# Altium project Bierautomat.PrjPcb
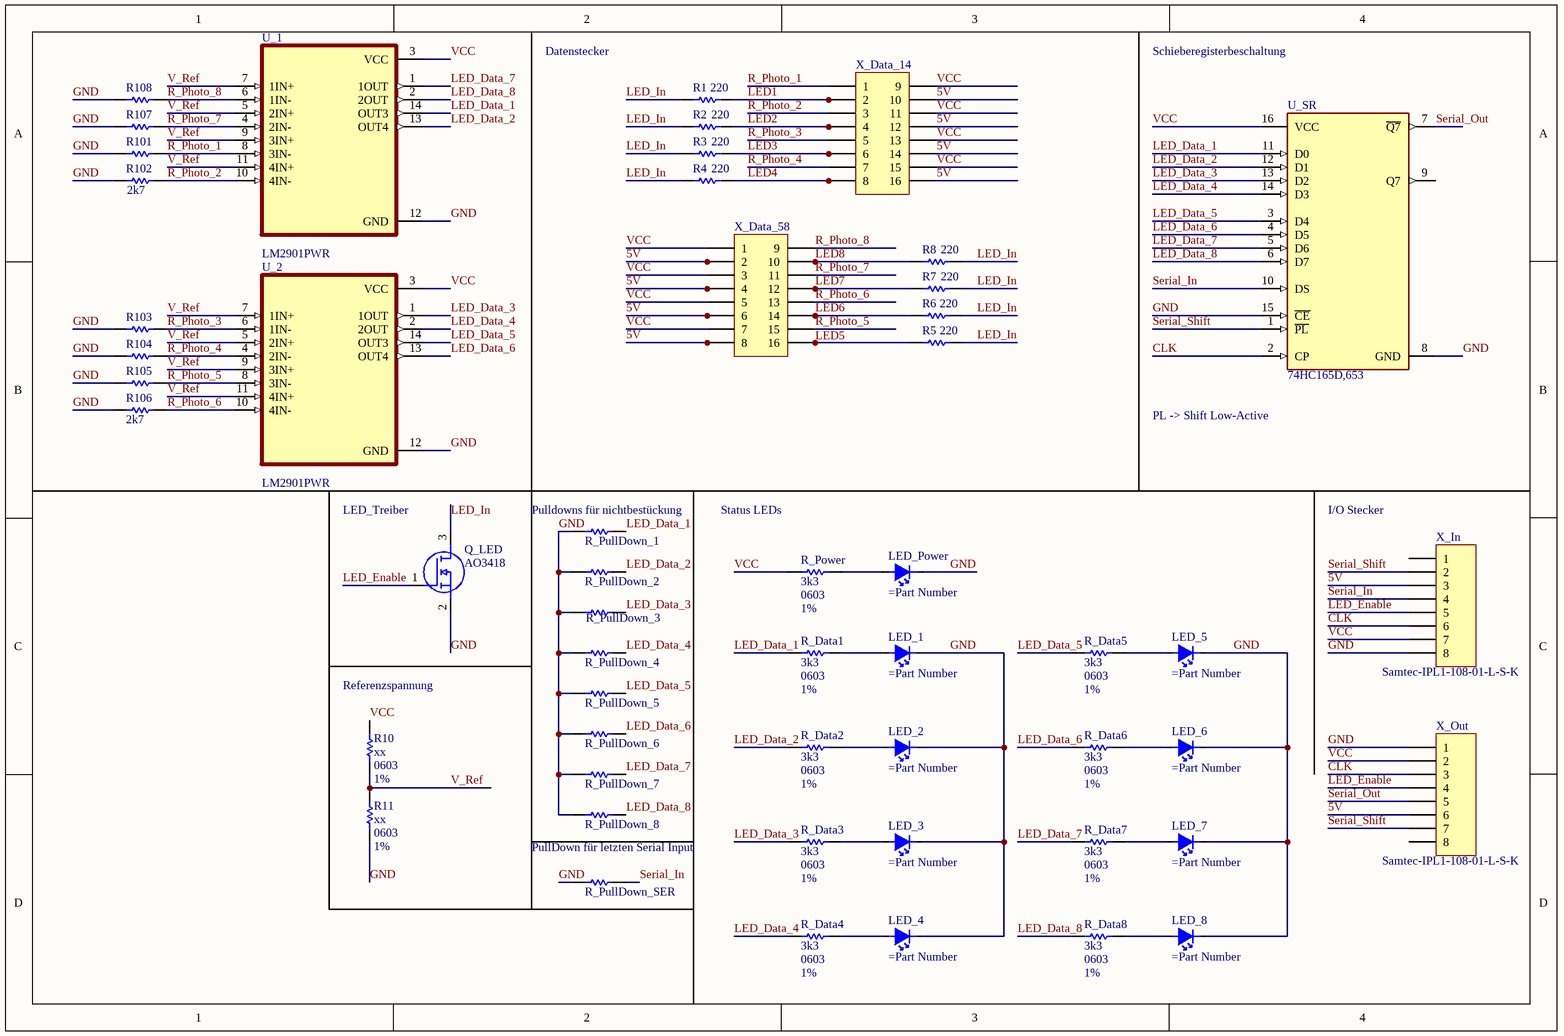
[diagram p0: Schieberegister_Trägerplatine.SchDoc]
3 sheets, 60 parts. Net scope: hierarchical (ports join the sheet entries above them; power ports are global).
Board files: ESP_Träger.PcbDoc, SR_Träger.PcbDoc
Sheets:
  Schieberegister_Trägerplatine.SchDoc
  ESP_Trägerplatine.SchDoc
    U_ESP_32 = ESP_32.SchDoc

## Sheet Schieberegister_Trägerplatine.SchDoc
size A4; SheetNumber: 1; SheetTotal: 1; SPICEModelCacheYDPVZOWB: <root> / <DocumentId>YDPVZOWB</DocumentId> / </root>

### Parts
LED_1  (no value)  [150060XX75000]
LED_2  (no value)  [150060XX75000]
LED_3  (no value)  [150060XX75000]
LED_4  (no value)  [150060XX75000]
LED_5  (no value)  [150060XX75000]
LED_6  (no value)  [150060XX75000]
LED_7  (no value)  [150060XX75000]
LED_8  (no value)  [150060XX75000]
LED_Power  (no value)  [150060XX75000]
Q_LED  AO3418  [SOT95P280X125-3N]
R1  value 220  [0603_resistor_flat]
R2  value 220  [0603_resistor_flat]
R3  value 220  [0603_resistor_flat]
R4  value 220  [0603_resistor_flat]
R5  value 220  [0603_resistor_flat]
R6  value 220  [0603_resistor_flat]
R7  value 220  [0603_resistor_flat]
R8  value 220  [0603_resistor_flat]
R10  value xx  Case_EIA: 0603  Tolerance: 1%  [0603_resistor_flat]
R11  value xx  Case_EIA: 0603  Tolerance: 1%  [0603_resistor_flat]
R101  (no value)  [0603_resistor_flat]
R102  2k7  [0603_resistor_flat]
R103  (no value)  [0603_resistor_flat]
R104  (no value)  [0603_resistor_flat]
R105  (no value)  [0603_resistor_flat]
R106  2k7  [0603_resistor_flat]
R107  (no value)  [0603_resistor_flat]
R108  (no value)  [0603_resistor_flat]
R_Data1  value 3k3  Case_EIA: 0603  Tolerance: 1%  [0603_resistor_flat]
R_Data2  value 3k3  Case_EIA: 0603  Tolerance: 1%  [0603_resistor_flat]
R_Data3  value 3k3  Case_EIA: 0603  Tolerance: 1%  [0603_resistor_flat]
R_Data4  value 3k3  Case_EIA: 0603  Tolerance: 1%  [0603_resistor_flat]
R_Data5  value 3k3  Case_EIA: 0603  Tolerance: 1%  [0603_resistor_flat]
R_Data6  value 3k3  Case_EIA: 0603  Tolerance: 1%  [0603_resistor_flat]
R_Data7  value 3k3  Case_EIA: 0603  Tolerance: 1%  [0603_resistor_flat]
R_Data8  value 3k3  Case_EIA: 0603  Tolerance: 1%  [0603_resistor_flat]
R_Power  value 3k3  Case_EIA: 0603  Tolerance: 1%  [0603_resistor_flat]
R_PullDown_1  (no value)  [0603_resistor_flat]
R_PullDown_2  (no value)  [0603_resistor_flat]
R_PullDown_3  (no value)  [0603_resistor_flat]
R_PullDown_4  (no value)  [0603_resistor_flat]
R_PullDown_5  (no value)  [0603_resistor_flat]
R_PullDown_6  (no value)  [0603_resistor_flat]
R_PullDown_7  (no value)  [0603_resistor_flat]
R_PullDown_8  (no value)  [0603_resistor_flat]
R_PullDown_SER  (no value)  [0603_resistor_flat]
U_1  LM2901PWR  [SOP65P640X120-14N]
U_2  LM2901PWR  [SOP65P640X120-14N]
U_SR  74HC165D,653  [FP-SOT109-1-MFG]
X_Data_14  Samtec-IPL1-108-01-L-D-K  [Samtec-IPL1-108-01-L-D-K]  (value not drawn)
X_Data_58  Samtec-IPL1-108-01-L-D-K  [Samtec-IPL1-108-01-L-D-K]  (value not drawn)
X_In  Samtec-IPL1-108-01-L-S-K  [Samtec-IPL1-108-01-L-S-K]
X_Out  Samtec-IPL1-108-01-L-S-K  [Samtec-IPL1-108-01-L-S-K]

### Nets
5V: X_Data_14.10 X_Data_14.12 X_Data_14.14 X_Data_14.16 X_Data_58.2 X_Data_58.4 X_Data_58.6 X_Data_58.8 X_In.3 X_Out.6
CLK: U_SR.2(CP) X_In.6 X_Out.3
GND: LED_1.1(Cathode) LED_2.1(Cathode) LED_3.1(Cathode) LED_4.1(Cathode) LED_5.1(Cathode) LED_6.1(Cathode) LED_7.1(Cathode) LED_8.1(Cathode) LED_Power.1(Cathode) Q_LED.2(S) R11.1 R101.1 R102.1 R103.1 R104.1 R105.1 R106.1 R107.1 R108.1 R_PullDown_1.1 R_PullDown_2.1 R_PullDown_3.1 R_PullDown_4.1 R_PullDown_5.1 R_PullDown_6.1 R_PullDown_7.1 R_PullDown_8.1 R_PullDown_SER.1 U_1.12(GND) U_2.12(GND) U_SR.8(GND) U_SR.15(~{CE}) X_In.8 X_Out.1
LED1: R1.1 X_Data_14.2
LED2: R2.1 X_Data_14.4
LED3: R3.1 X_Data_14.6
LED4: R4.1 X_Data_14.8
LED5: R5.1 X_Data_58.16
LED6: R6.1 X_Data_58.14
LED7: R7.1 X_Data_58.12
LED8: R8.1 X_Data_58.10
LED_Data_1: R_Data1.2 R_PullDown_1.2 U_1.14(OUT3) U_SR.11(D0)
LED_Data_2: R_Data2.2 R_PullDown_2.2 U_1.13(OUT4) U_SR.12(D1)
LED_Data_3: R_Data3.2 R_PullDown_3.2 U_2.1(1OUT) U_SR.13(D2)
LED_Data_4: R_Data4.2 R_PullDown_4.2 U_2.2(2OUT) U_SR.14(D3)
LED_Data_5: R_Data5.2 R_PullDown_5.2 U_2.14(OUT3) U_SR.3(D4)
LED_Data_6: R_Data6.2 R_PullDown_6.2 U_2.13(OUT4) U_SR.4(D5)
LED_Data_7: R_Data7.2 R_PullDown_7.2 U_1.1(1OUT) U_SR.5(D6)
LED_Data_8: R_Data8.2 R_PullDown_8.2 U_1.2(2OUT) U_SR.6(D7)
LED_Enable: Q_LED.1(G) X_In.5 X_Out.4
LED_In: Q_LED.3(D) R1.2 R2.2 R3.2 R4.2 R5.2 R6.2 R7.2 R8.2
R_Photo_1: R101.2 U_1.8(3IN-) X_Data_14.1
R_Photo_2: R102.2 U_1.10(4IN-) X_Data_14.3
R_Photo_3: R103.2 U_2.6(1IN-) X_Data_14.5
R_Photo_4: R104.2 U_2.4(2IN-) X_Data_14.7
R_Photo_5: R105.2 U_2.8(3IN-) X_Data_58.15
R_Photo_6: R106.2 U_2.10(4IN-) X_Data_58.13
R_Photo_7: R107.2 U_1.4(2IN-) X_Data_58.11
R_Photo_8: R108.2 U_1.6(1IN-) X_Data_58.9
Serial_In: R_PullDown_SER.2 U_SR.10(DS) X_In.4
Serial_Out: U_SR.7(~{Q7}) X_Out.5
Serial_Shift: U_SR.1(~{PL}) X_In.2 X_Out.7
V_Ref: R10.1 R11.2 U_1.5(2IN+) U_1.7(1IN+) U_1.9(3IN+) U_1.11(4IN+) U_2.5(2IN+) U_2.7(1IN+) U_2.9(3IN+) U_2.11(4IN+)
VCC: R10.2 R_Power.2 U_1.3(VCC) U_2.3(VCC) U_SR.16(VCC) X_Data_14.9 X_Data_14.11 X_Data_14.13 X_Data_14.15 X_Data_58.1 X_Data_58.3 X_Data_58.5 X_Data_58.7 X_In.7 X_Out.2
NetLED_1_2: LED_1.2(Anode) R_Data1.1
NetLED_2_2: LED_2.2(Anode) R_Data2.1
NetLED_3_2: LED_3.2(Anode) R_Data3.1
NetLED_4_2: LED_4.2(Anode) R_Data4.1
NetLED_5_2: LED_5.2(Anode) R_Data5.1
NetLED_6_2: LED_6.2(Anode) R_Data6.1
NetLED_7_2: LED_7.2(Anode) R_Data7.1
NetLED_8_2: LED_8.2(Anode) R_Data8.1
NetLED_Power_2: LED_Power.2(Anode) R_Power.1

Not connected (* = marked no-connect by the designer): U_SR 9(Q7); X_In 1; X_Out 8

### Notes on the sheet
- Datenstecker
- Schieberegisterbeschaltung
- PL -> Shift Low-Active
- (near Q_LED) LED_Treiber
- (near R_PullDown_1) Pulldowns für nichtbestückung
- Status LEDs
- I/O Stecker
- (near R10) Referenzspannung
- PullDown für letzten Serial Input

### Library data of the parts
LED_1-LED_8 LED_Power = LED_0603: 0603 SMD mono-color Chip LED, WL-SMCW / BS: Blue, GS: Green, RS: Red, SS: super red, VS: bright green, YS: yellow; Part Number: 150060*75000; Manufacturer: Würth; possible_colors: BS, GS, RS, SS, VS, YS; Case_EIA: 0603; Color: *
Q_LED = AO3418: MOSFET N-CH 30V 3.8A SOT23; Manufacturer_Name: Alpha & Omega Semiconductors; Geometry.Height: 1.25mm; Arrow Part Number: AO3418; Arrow Price/Stock: https://www.arrow.com/en/products/ao3418/alpha-and-omega-semiconductor; Manufacturer_Part_Number: AO3418; Datasheet Link: https://www.arrow.com/en/products/ao3418/alpha-and-omega-semiconductor
R1-R8 R101-R108 R_PullDown_1-R_PullDown_8 R_PullDown_SER = R_0603: Resistor, 0603, 5% default, 0.1 W; E12: 1K0, 1K2, 1K5, 1K8, 2K2, 2K7, 3K3, 3K9, 4K7, 5K6, 6K8, 8K2; Case_Metric: 1608; Power_Dissipation: 100mW; Part Number: ='R_' + Case_EIA + '_' + Tolerance + '_' + Value
R10 R11 = R_0603: Resistor, 0603, 5% default, 0.1 W; Part Number: R_0603_1%_xx; E12: 1K0, 1K2, 1K5, 1K8, 2K2, 2K7, 3K3, 3K9, 4K7, 5K6, 6K8, 8K2; Case_Metric: 1608; Power_Dissipation: 100mW
R_Data1-R_Data8 R_Power = R_0603: Resistor, 0603, 5% default, 0.1 W; Part Number: R_0603_1%_3k3; E12: 1K0, 1K2, 1K5, 1K8, 2K2, 2K7, 3K3, 3K9, 4K7, 5K6, 6K8, 8K2; Case_Metric: 1608; Power_Dissipation: 100mW
U_1 U_2 = LM2901PWR: Quad differential comparator, automotive grade 14-TSSOP -40 to 125; MF: Texas; Check_prices: https://www.snapeda.com/parts/LM2901PWR/Texas%20Instruments/view-part/1145769/?ref=eda; Price: None; SnapEDA_Link: https://www.snapeda.com/parts/LM2901PWR/Texas%20Instruments/view-part/1145769/?ref=snap; Availability: Good; MP: LM2901PWR; Value: *; Purchase-URL: https://pricing.snapeda.com/search/part/LM2901PWR/?ref=eda; Package: TSSOP-14 Rohm
U_SR = CMP-14351-000001-1: IC SHIFT REGST 8BIT PI-SO 16SOIC; Manufacturer: Nexperia; Standoff Height: 0.1mm; Number Of Inputs: 8; Logic Function Desc: Shift Register; Nominal Supply Current: 8uA; Number Of Circuits: 1; Propagation Delay: 15ns; Min Supply Voltage: 2V; Frequency: 61MHz; Max Supply Voltage: 6V; Height: 1.75mm; Digikey Description: IC SHIFT REGST 8BIT PI-SO 16SOIC; ComponentLink2URL: https://assets.nexperia.com/documents/data-sheet/74HC_HCT165.pdf; Ipc Land Pattern Name: SOP127P600X175-16; Temperature Range High: +125°C; Manufacturer Part Number: 74HC165D,653; Temperature: -40°C to +125°C; Device Class L2: Logic ICs; Device Class L1: Integrated Circuits (ICs); Lead Free: Yes; Number Of Outputs: 1; Ambient Temperature Range High: +125°C; ComponentLink2Description: Datasheet; Temperature Range Low: -40°C; Category: IC; RoHS: TRUE; Automotive: No; Device Class L3: Shift Registers; Octopart: https://octopart.com/74hc165d%2C653-nexperia-78737091; Footprint Url: https://assets.nexperia.com/documents/outline-drawing/SOT109-1.pdf; Ambient Temperature Range Low: -40°C; Package: SOT109-1
X_Data_14 X_Data_58 = Samtec-IPL1-108-01-L-D-K: Header, 8-Pin, Dual row; Value: Samtec; LatestRevisionDate: 17-Jul-2002; LatestRevisionNote: Re-released for DXP Platform.; Publisher: Altium Limited
X_In X_Out = IPL1-108-01-L-S-K: Header, 8-Pin; LatestRevisionDate: 17-Jul-2002; LatestRevisionNote: Re-released for DXP Platform.; Publisher: Altium Limited; Value: Samtec-IPL1-108-01-L-S-K

## Sheet ESP_Trägerplatine.SchDoc
size A4; SheetNumber: 1; SheetTotal: 3
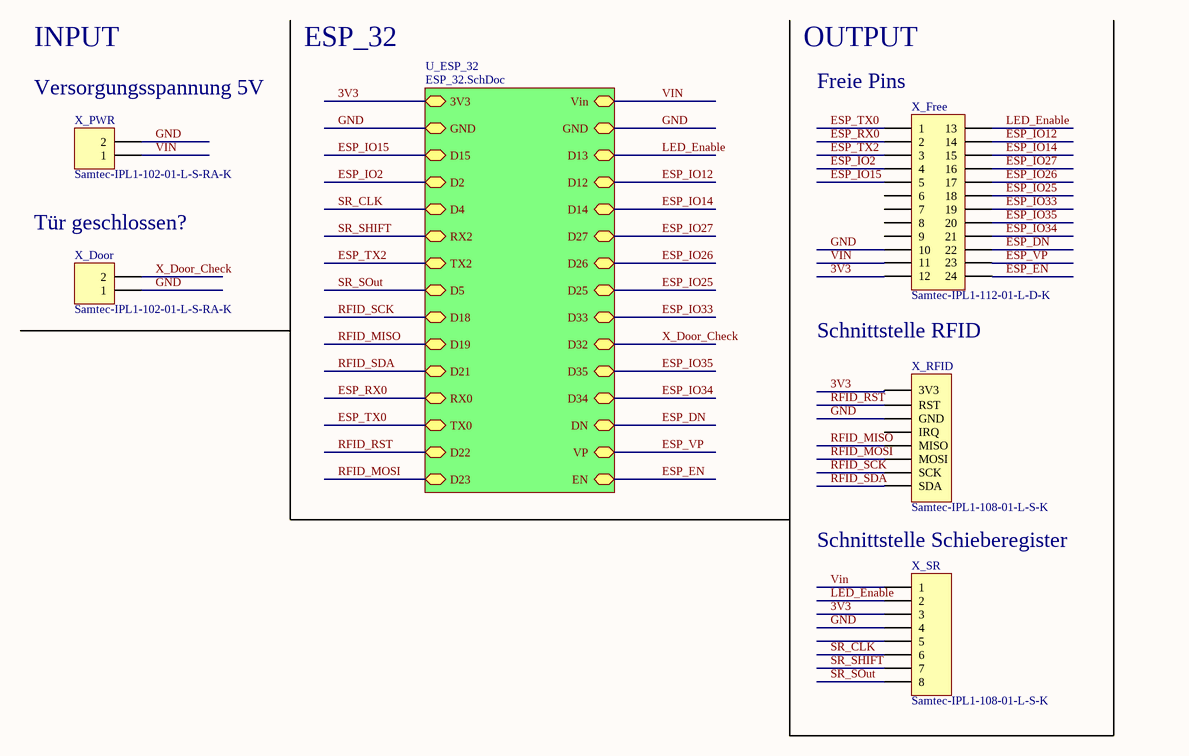
[diagram p1: ESP_Trägerplatine.SchDoc]

### Parts
X_Door  Samtec-IPL1-102-01-L-S-RA-K  [Samtec-IPL1-102-01-L-S-RA-K]
X_Free  Samtec-IPL1-112-01-L-D-K  [Samtec-IPL1-112-01-L-D-K]
X_PWR  Samtec-IPL1-102-01-L-S-RA-K  [Samtec-IPL1-102-01-L-S-RA-K]
X_RFID  Samtec-IPL1-108-01-L-S-K  [Samtec-IPL1-108-01-L-S-K]
X_SR  Samtec-IPL1-108-01-L-S-K  [Samtec-IPL1-108-01-L-S-K]

### Sub-sheets
U_ESP_32 = ESP_32.SchDoc: 3V3 (bidir), GND (bidir), D15 (bidir), D2 (bidir), D4 (bidir), RX2 (bidir), TX2 (bidir), D5 (bidir), D18 (bidir), D19 (bidir), D21 (bidir), RX0 (bidir), TX0 (bidir), D22 (bidir), D23 (bidir), Vin (bidir), GND (bidir), D13 (bidir), D12 (bidir), D14 (bidir), D27 (bidir), D26 (bidir), D25 (bidir), D33 (bidir), D32 (bidir), D35 (bidir), D34 (bidir), DN (bidir), VP (bidir), EN (bidir)

### Nets
3V3: X_Free.12 X_RFID.1(3V3) X_SR.3 ; sheet U_ESP_32/3V3
ESP_DN: X_Free.22 ; sheet U_ESP_32/DN
ESP_EN: X_Free.24 ; sheet U_ESP_32/EN
ESP_IO2: X_Free.4 ; sheet U_ESP_32/D2
ESP_IO12: X_Free.14 ; sheet U_ESP_32/D12
ESP_IO14: X_Free.15 ; sheet U_ESP_32/D14
ESP_IO15: X_Free.5 ; sheet U_ESP_32/D15
ESP_IO25: X_Free.18 ; sheet U_ESP_32/D25
ESP_IO26: X_Free.17 ; sheet U_ESP_32/D26
ESP_IO27: X_Free.16 ; sheet U_ESP_32/D27
ESP_IO33: X_Free.19 ; sheet U_ESP_32/D33
ESP_IO34: X_Free.21 ; sheet U_ESP_32/D34
ESP_IO35: X_Free.20 ; sheet U_ESP_32/D35
ESP_RX0: X_Free.2 ; sheet U_ESP_32/RX0
ESP_TX0: X_Free.1 ; sheet U_ESP_32/TX0
ESP_TX2: X_Free.3 ; sheet U_ESP_32/TX2
ESP_VP: X_Free.23 ; sheet U_ESP_32/VP
GND: X_Door.1 X_Free.10 X_PWR.2 X_RFID.3(GND) X_SR.4 ; sheet U_ESP_32/GND, sheet U_ESP_32/GND
LED_Enable: X_Free.13 X_SR.2 ; sheet U_ESP_32/D13
RFID_MISO: X_RFID.5(MISO) ; sheet U_ESP_32/D19
RFID_MOSI: X_RFID.6(MOSI) ; sheet U_ESP_32/D23
RFID_RST: X_RFID.2(RST) ; sheet U_ESP_32/D22
RFID_SCK: X_RFID.7(SCK) ; sheet U_ESP_32/D18
RFID_SDA: X_RFID.8(SDA) ; sheet U_ESP_32/D21
SR_CLK: X_SR.6 ; sheet U_ESP_32/D4
SR_SHIFT: X_SR.7 ; sheet U_ESP_32/RX2
SR_SOut: X_SR.8 ; sheet U_ESP_32/D5
VIN: X_Free.11 X_PWR.1 X_SR.1 ; sheet U_ESP_32/Vin
X_Door_Check: X_Door.2 ; sheet U_ESP_32/D32

Not connected (* = marked no-connect by the designer): X_Free 6 7 8 9; X_RFID 4(IRQ); X_SR 5

### Notes on the sheet
- INPUT
- (near X_PWR) Versorgungsspannung 5V
- ESP_32
- OUTPUT
- (near X_Free) Freie Pins
- Tür geschlossen?
- Schnittstelle RFID
- Schnittstelle Schieberegister

### Library data of the parts
X_Door X_PWR = Samtec-IPL1-102-01-L-S-RA-K: Samtec IPL1 .100", 2polig, eine Reihe, 90° gewinkelt; Manufacturer: Samtec; Part Number: IPL1-102-01-L-S-RA-K
X_Free = IPL1-112-01-L-D-K: Header, 12-Pin, Dual row; LatestRevisionDate: 17-Jul-2002; LatestRevisionNote: Re-released for DXP Platform.; Publisher: Altium Limited; Value: Samtec-IPL1-112-01-L-D-K
X_RFID = Samtec-IPL1-108-01-L-S-K: Samtec IPL1 .100", 8-polig, eine Reihe; Manufacturer: Samtec; Part Number: IPL1-108-01-L-S-K
X_SR = IPL1-108-01-L-S-K: Header, 8-Pin; LatestRevisionDate: 17-Jul-2002; LatestRevisionNote: Re-released for DXP Platform.; Publisher: Altium Limited; Value: Samtec-IPL1-108-01-L-S-K

## Sheet ESP_32.SchDoc
size A3; SheetNumber: 3; SheetTotal: 4
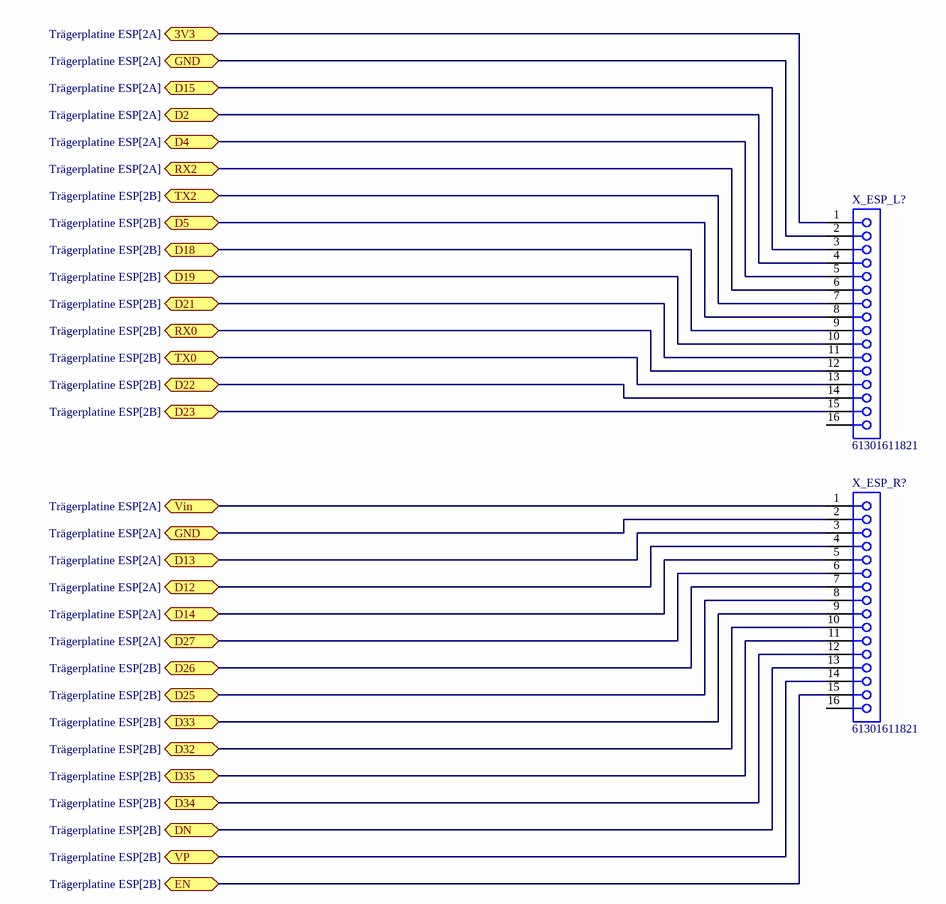
[diagram p2: ESP_32.SchDoc]

### Parts
X_ESP_L?  61301611821  [61301611821]
X_ESP_R?  61301611821  [61301611821]

### Ports
3V3 (bidir, see Trägerplatine ESP[2A]), D2 (bidir, see Trägerplatine ESP[2A]), D4 (bidir, see Trägerplatine ESP[2A]), D5 (bidir, see Trägerplatine ESP[2B]), D12 (bidir, see Trägerplatine ESP[2A]), D13 (bidir, see Trägerplatine ESP[2A]), D14 (bidir, see Trägerplatine ESP[2A]), D15 (bidir, see Trägerplatine ESP[2A]), D18 (bidir, see Trägerplatine ESP[2B]), D19 (bidir, see Trägerplatine ESP[2B]), D21 (bidir, see Trägerplatine ESP[2B]), D22 (bidir, see Trägerplatine ESP[2B]), D23 (bidir, see Trägerplatine ESP[2B]), D25 (bidir, see Trägerplatine ESP[2B]), D26 (bidir, see Trägerplatine ESP[2B]), D27 (bidir, see Trägerplatine ESP[2A]), D32 (bidir, see Trägerplatine ESP[2B]), D33 (bidir, see Trägerplatine ESP[2B]), D34 (bidir, see Trägerplatine ESP[2B]), D35 (bidir, see Trägerplatine ESP[2B]), DN (bidir, see Trägerplatine ESP[2B]), EN (bidir, see Trägerplatine ESP[2B]), GND (bidir, see Trägerplatine ESP[2A]), RX0 (bidir, see Trägerplatine ESP[2B]), RX2 (bidir, see Trägerplatine ESP[2A]), TX0 (bidir, see Trägerplatine ESP[2B]), TX2 (bidir, see Trägerplatine ESP[2B]), Vin (bidir, see Trägerplatine ESP[2A]), VP (bidir, see Trägerplatine ESP[2B])

### Nets
3V3: X_ESP_L?.1 ; port 3V3
ESP_DN: X_ESP_R?.13 ; port DN
ESP_EN: X_ESP_R?.15 ; port EN
ESP_IO2: X_ESP_L?.4 ; port D2
ESP_IO12: X_ESP_R?.4 ; port D12
ESP_IO14: X_ESP_R?.5 ; port D14
ESP_IO15: X_ESP_L?.3 ; port D15
ESP_IO25: X_ESP_R?.8 ; port D25
ESP_IO26: X_ESP_R?.7 ; port D26
ESP_IO27: X_ESP_R?.6 ; port D27
ESP_IO33: X_ESP_R?.9 ; port D33
ESP_IO34: X_ESP_R?.12 ; port D34
ESP_IO35: X_ESP_R?.11 ; port D35
ESP_RX0: X_ESP_L?.12 ; port RX0
ESP_TX0: X_ESP_L?.13 ; port TX0
ESP_TX2: X_ESP_L?.7 ; port TX2
ESP_VP: X_ESP_R?.14 ; port VP
GND: X_ESP_L?.2 X_ESP_R?.2 ; port GND
LED_Enable: X_ESP_R?.3 ; port D13
RFID_MISO: X_ESP_L?.10 ; port D19
RFID_MOSI: X_ESP_L?.15 ; port D23
RFID_RST: X_ESP_L?.14 ; port D22
RFID_SCK: X_ESP_L?.9 ; port D18
RFID_SDA: X_ESP_L?.11 ; port D21
SR_CLK: X_ESP_L?.5 ; port D4
SR_SHIFT: X_ESP_L?.6 ; port RX2
SR_SOut: X_ESP_L?.8 ; port D5
VIN: X_ESP_R?.1 ; port Vin
X_Door_Check: X_ESP_R?.10 ; port D32

Not connected (* = marked no-connect by the designer): X_ESP_L? 16; X_ESP_R? 16

### Notes on the sheet
- Engineer:
- Drawn By:
- Number:
- Rev:
- Project Title:
- File:
- Assembly Variant:
- Mod. Date:
- Sheet:
- Size:
- of
- A3
- Approved:
- Contact:

### Library data of the parts
X_ESP_L? X_ESP_R? = CMP-1502-01343-3: NexarPartId: 23389750; Operating Supply Voltage: 250V; Contact Resistance: 20mΩ; Current Rating: 3A; Gender: Female; Number of Pins: 16; Orientation: Vertical; Contact Material: Copper; Lead Free: Lead Free; Lead Pitch: 2.54mm; RoHS: Compliant

## Nets that join several sheets
3V3: ESP_Trägerplatine (X_Free.12 X_RFID.1 X_SR.3), ESP_32 (X_ESP_L?.1)
ESP_DN: ESP_Trägerplatine (X_Free.22), ESP_32 (X_ESP_R?.13)
ESP_EN: ESP_Trägerplatine (X_Free.24), ESP_32 (X_ESP_R?.15)
ESP_IO2: ESP_Trägerplatine (X_Free.4), ESP_32 (X_ESP_L?.4)
ESP_IO12: ESP_Trägerplatine (X_Free.14), ESP_32 (X_ESP_R?.4)
ESP_IO14: ESP_Trägerplatine (X_Free.15), ESP_32 (X_ESP_R?.5)
ESP_IO15: ESP_Trägerplatine (X_Free.5), ESP_32 (X_ESP_L?.3)
ESP_IO25: ESP_Trägerplatine (X_Free.18), ESP_32 (X_ESP_R?.8)
ESP_IO26: ESP_Trägerplatine (X_Free.17), ESP_32 (X_ESP_R?.7)
ESP_IO27: ESP_Trägerplatine (X_Free.16), ESP_32 (X_ESP_R?.6)
ESP_IO33: ESP_Trägerplatine (X_Free.19), ESP_32 (X_ESP_R?.9)
ESP_IO34: ESP_Trägerplatine (X_Free.21), ESP_32 (X_ESP_R?.12)
ESP_IO35: ESP_Trägerplatine (X_Free.20), ESP_32 (X_ESP_R?.11)
ESP_RX0: ESP_Trägerplatine (X_Free.2), ESP_32 (X_ESP_L?.12)
ESP_TX0: ESP_Trägerplatine (X_Free.1), ESP_32 (X_ESP_L?.13)
ESP_TX2: ESP_Trägerplatine (X_Free.3), ESP_32 (X_ESP_L?.7)
ESP_VP: ESP_Trägerplatine (X_Free.23), ESP_32 (X_ESP_R?.14)
GND: ESP_Trägerplatine (5 pins), ESP_32 (X_ESP_L?.2 X_ESP_R?.2)
LED_Enable: ESP_Trägerplatine (X_Free.13 X_SR.2), ESP_32 (X_ESP_R?.3)
RFID_MISO: ESP_Trägerplatine (X_RFID.5), ESP_32 (X_ESP_L?.10)
RFID_MOSI: ESP_Trägerplatine (X_RFID.6), ESP_32 (X_ESP_L?.15)
RFID_RST: ESP_Trägerplatine (X_RFID.2), ESP_32 (X_ESP_L?.14)
RFID_SCK: ESP_Trägerplatine (X_RFID.7), ESP_32 (X_ESP_L?.9)
RFID_SDA: ESP_Trägerplatine (X_RFID.8), ESP_32 (X_ESP_L?.11)
SR_CLK: ESP_Trägerplatine (X_SR.6), ESP_32 (X_ESP_L?.5)
SR_SHIFT: ESP_Trägerplatine (X_SR.7), ESP_32 (X_ESP_L?.6)
SR_SOut: ESP_Trägerplatine (X_SR.8), ESP_32 (X_ESP_L?.8)
VIN: ESP_Trägerplatine (X_Free.11 X_PWR.1 X_SR.1), ESP_32 (X_ESP_R?.1)
X_Door_Check: ESP_Trägerplatine (X_Door.2), ESP_32 (X_ESP_R?.10)